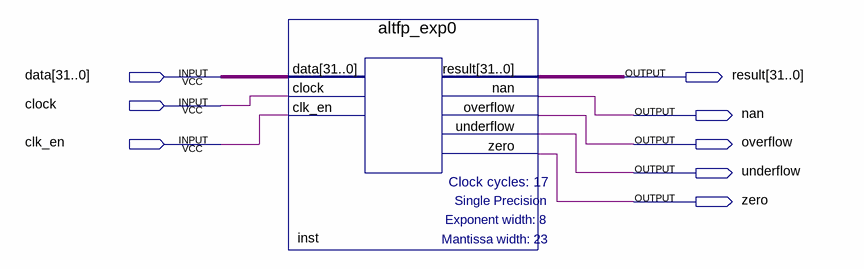
[diagram p0: schematic sheet]
// Quartus schematic lab11_1.bdf as structural Verilog: 1 symbols, 8 pins
module lab11_1 (
  input  [31:0] data,
  input  clock,
  input  clk_en,
  output [31:0] result,
  output nan,
  output overflow,
  output underflow,
  output zero
);

  altfp_exp0 inst (
    .data(data), .clock(clock), .clk_en(clk_en), .result(result), .nan(nan), .overflow(overflow),
    .underflow(underflow), .zero(zero));
endmodule
